# Altium schematic sheet Schematic.SchDoc
size A4; SheetNumber: 1; SheetTotal: 1; SPICEModelCacheFIKDJLXQ: <root> / <DocumentId>FIKDJLXQ</DocumentId> / </root>
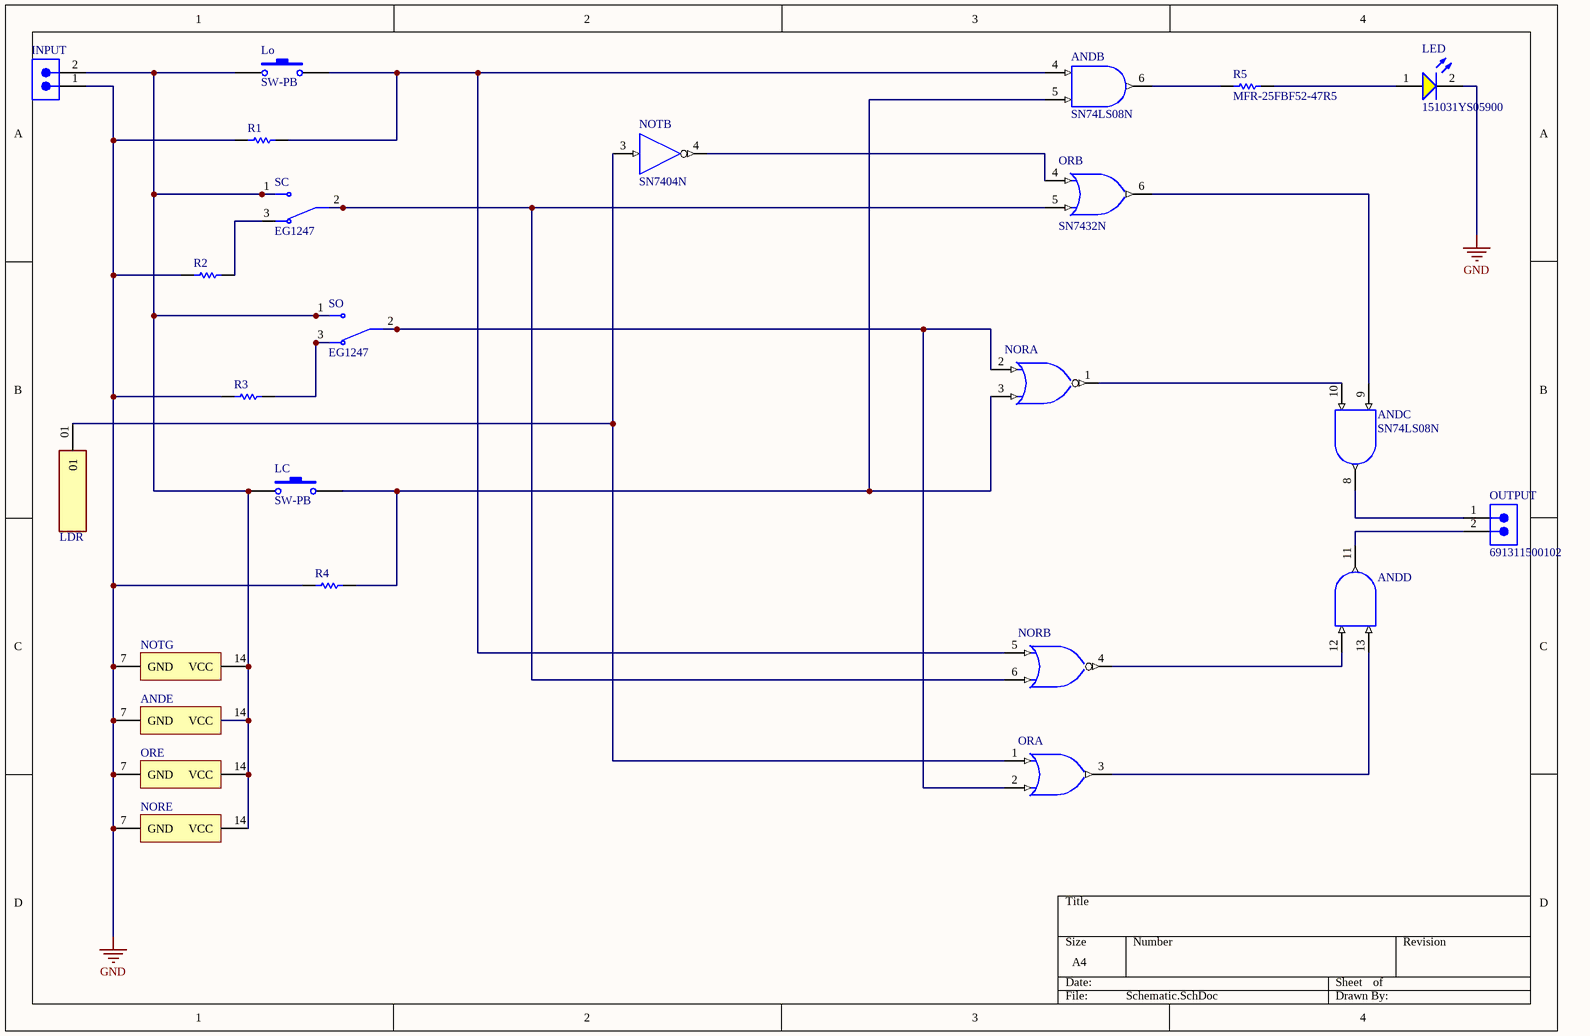
[diagram p0: Schematic.SchDoc]

## Parts
AND  SN74LS08N  [N0014A]  (parts B,C,D,E of 5)
INPUT  (no value)  [691311500102]
LC  SW-PB  [SPST-2]
LDR  (no value)  [SAMTEC_HTSW-101-06-T-S]
LED  151031YS05900  [WL-TMRC_D3.95H5.3]
Lo  SW-PB  [SPST-2]
NOR  (no value)  [N0014A]  (parts A,B,E of 5)
NOT  SN7404N  [N0014A]  (parts B,G of 7)
OR  (no value)  [N0014A]  (parts A,B,E of 5)
OUTPUT  691311500102  [691311500102]
R1  (no value)  [RESA60-630X240]
R2  (no value)  [RESA60-630X240]
R3  (no value)  [RESA60-630X240]
R4  (no value)  [RESA60-630X240]
R5  MFR-25FBF52-47R5  [RESA60-630X240]
SC  EG1247  [SW_EG1247]
SO  EG1247  [SW_EG1247]

## Nets
GND: AND.7(GND) INPUT.1 LED.2(K) NOR.7(GND) NOT.7(GND) OR.7(GND) R1.1 R2.1 R3.1 R4.1
NetAND_4: AND.4(2A) Lo.2 NOR.5(2A) R1.2
NetAND_5: AND.5(2B) LC.2 NOR.3(1B) R4.2
NetAND_6: AND.6(2Y) R5.1
NetAND_8: AND.8(3Y) OUTPUT.1
NetAND_9: AND.9(3A) OR.6(2Y)
NetAND_10: AND.10(3B) NOR.1(1Y)
NetAND_11: AND.11(4Y) OUTPUT.2
NetAND_12: AND.12(4A) NOR.4(2Y)
NetAND_13: AND.13(4B) OR.3(1Y)
NetAND_14: AND.14(VCC) INPUT.2 LC.1 Lo.1 NOR.14(VCC) NOT.14(VCC) OR.14(VCC) SC.1 SO.1
NetLDR_01: LDR.01 NOT.3(2A) OR.1(1A)
NetLED_1: LED.1(A) R5.2
NetNOR_2: NOR.2(1A) OR.2(1B) SO.2
NetNOR_6: NOR.6(2B) OR.5(2B) SC.2
NetNOT_4: NOT.4(~{2Y}) OR.4(2A)
NetR2_2: R2.2 SC.3
NetR3_2: R3.2 SO.3

## Library data of the parts
AND = CMP-0777-00259-3: Quadruple 2-Input Positive-AND Gates, N0014A, TUBE; Manufacturer: Texas Instruments; VCC(Max)(V): 5.25; ICC @ Nom Voltage(Max)(mA): 0.021; VCC(Min)(V): 4.75; tpd @ Nom Voltage(Max)(ns): 25; Rating: Catalog; Output Type: TTL; Bits(#): 4; Schmitt Trigger: No; Voltage(Nom)(V): 5; Technology Family: LS; F @ Nom Voltage(Max)(Mhz): 35; Output Drive (IOL/IOH)(Max)(mA): -0.8/16; PackageReference: N0014A; DatasheetVersion: SDLS033; Input Type: TTL; Operating Temperature Range(C): 0 to 70; Generic Part Number: SN74LS08
INPUT OUTPUT = CMP-1502-02146-2: NexarPartId: 8917747; Number of Positions Per Level: 2; Pitch: 5.08mm; Voltage: 300V; Current: 20A; Gender: Male; Number of Levels: 1; Termination: Solder; Lead Pitch: 5.08mm; RoHS: Compliant; Number of Pins: 2; Orientation: Vertical; REACH SVHC: Unknown; Height: 12mm; Contact Material: Brass; Width: 11.5mm; Number of Contacts: 2; Mount: Through Hole; Contact Plating: Tin; Color: Green; Max Operating Temperature: 105°C; Packaging: Box; Length: 8.5mm; Number of Rows: 1; Voltage Rating: 300V; Current Rating: 20A; Min Operating Temperature: -40°C
LC Lo = SW-PB: Switch; Published: 24-Mar-1999; LatestRevisionDate: 17-Jul-2002; LatestRevisionNote: Re-released for DXP Platform.; PackageReference: SPST-2; Publisher: Altium Limited; PackageDescription: Switch; 2 Leads
LDR = HTSW-101-06-T-S: MP: HTSW-101-06-T-S; Availability: Unavailable; Package: None; Price: None; Value: *
LED = CMP-1488-00003-2: NexarPartId: 29717806; Wavelength: 585nm; Forward Voltage: 2.1V; Lens Style: Circular, Diffused, Round; Viewing Angle: 60°; Forward Current: 100mA; Dominant Wavelength: 590nm; Test Current: 20mA; Max Reverse Voltage (DC): 5V; Luminous Intensity: 30mcd; Lens Size: 3mm; Max Operating Temperature: 85°C; Mount: Through Hole; Color: Yellow; Length: 3mm; Packaging: Bulk; Width: 3mm; Height: 5.3mm; Min Operating Temperature: -40°C; RoHS: Compliant; REACH SVHC: Unknown; Case/Package: Radial; Peak Wavelength: 585nm
NOR = CMP-0806-00203-3: Quad 2-input Positive-NOR gates, N0014A, TUBE; Generic Part Number: SN7402; Manufacturer: Texas Instruments; Input Type: TTL; F @ Nom Voltage(Max)(Mhz): 75; VCC(Max)(V): 5.25; VCC(Min)(V): 4.75; Voltage(Nom)(V): 5; Rating: Catalog; Bits(#): 4; ICC @ Nom Voltage(Max)(mA): 0.027; Output Drive (IOL/IOH)(Max)(mA): 0.8/-16; tpd @ Nom Voltage(Max)(ns): 22; Code_JEDEC: MS-001; PackageVersion: http://www.ti.com/lit/ml/mpdi002c/mpdi002c.pdf; Operating Temperature Range(C): 0 to 70; Output Type: TTL; PackageReference: N0014A; DatasheetVersion: SDLS027
NOT = CMP-1615-00872-2: Hex inverters, N0014A, TUBE; Generic Part Number: SN7404; Manufacturer: Texas Instruments; Voltage(Nom)(V): 5; Bits(#): 6; tpd @ Nom Voltage(Max)(ns): 22; Schmitt Trigger: No; VCC(Max)(V): 5.25; ICC @ Nom Voltage(Max)(mA): 0.033; Technology Family: TTL; Rating: Catalog; F @ Nom Voltage(Max)(Mhz): 35; Output Type: CMOS; VCC(Min)(V): 4.75; Output Drive (IOL/IOH)(Max)(mA): -0.4/16; DatasheetVersion: SDLS029C; Code_JEDEC: MS-001; Operating Temperature Range(C): 0 to 70; PackageReference: N0014A; Input Type: TTL
OR = CMP-1573-00140-3: Quad 2-input positive-OR gates, N0014A, TUBE; Manufacturer: Texas Instruments; Generic Part Number: SN7432; VCC(Max)(V): 5.25; Voltage(Nom)(V): 5; VCC(Min)(V): 4.75; F @ Nom Voltage(Max)(Mhz): 100; Output Type: TTL; Output Drive (IOL/IOH)(Max)(mA): 0.8/-16; ICC @ Nom Voltage(Max)(mA): 0.038; Bits(#): 4; tpd @ Nom Voltage(Max)(ns): 22; Rating: Catalog; PackageVersion: http://www.ti.com/lit/ml/mpdi002c/mpdi002c.pdf; Operating Temperature Range(C): 0 to 70; DatasheetVersion: SDLS100; Code_JEDEC: MS-001; Input Type: TTL; PackageReference: N0014A
R1-R5 = CMP-1659-00067-1: Axial Resistor, 47.5 Ohm, +/- 1%, 0.25 W, -55 to 155 degC, 2-Pin THD, RoHS, Bulk; Nominal Voltage Gain: 100 dB; Slew Rate: 1 V\us; Common Mode Rejection Ratio: 50 dB; Bandwidth: 1 MHz; Min Supply Voltage: 3 V; Case\Package: SOIC; Output Current: 160 mA; Channels: 4; Max Supply Voltage: 5 V; Nominal Supply Current: 170 uA; Packaging: Tape and Reel; Pins: 14; ComponentLink1URL: http://www.yageo.com/; RoHSCompliant: true; Radiation Hardening: No; Width: 3.91 mm; ComponentLink2Description: Datasheet; PackageReference: MFR-25; Length: 8.65 mm; ComponentLink1Description: Manufacturer URL; Mount: Surface Mount; Nominal Gain Bandwith Product: 1 MHz; DatasheetVersion: Apr-13; Unity Gain Bandwidth Product: 1 MHz; Min Operating Temperature: -40 degC; Max Operating Temperature: 85 degC; PackageDescription: 2-Pin Axial Lead, Dia 2.4 mm, Body Length 6.3 mm; ComponentLink2URL: http://www.yageo.com/documents/recent/Yageo%20LR_MFR_2013.pdf; Package Quantity: 2500; Height: 1.58 mm; REACH SVHC: No SVHC
SC SO = EG1247: Slide Switch SPDT Through Hole, Right Angle; MF: E-Switch; Availability: In Stock; Value: *; Price: None; Check_prices: https://www.snapeda.com/parts/EG1247/E-Switch/view-part/?ref=eda; Purchase-URL: https://pricing.snapeda.com/search/part/EG1247/?ref=eda; SnapEDA_Link: https://www.snapeda.com/parts/EG1247/E-Switch/view-part/?ref=snap; MP: EG1247; Package: None